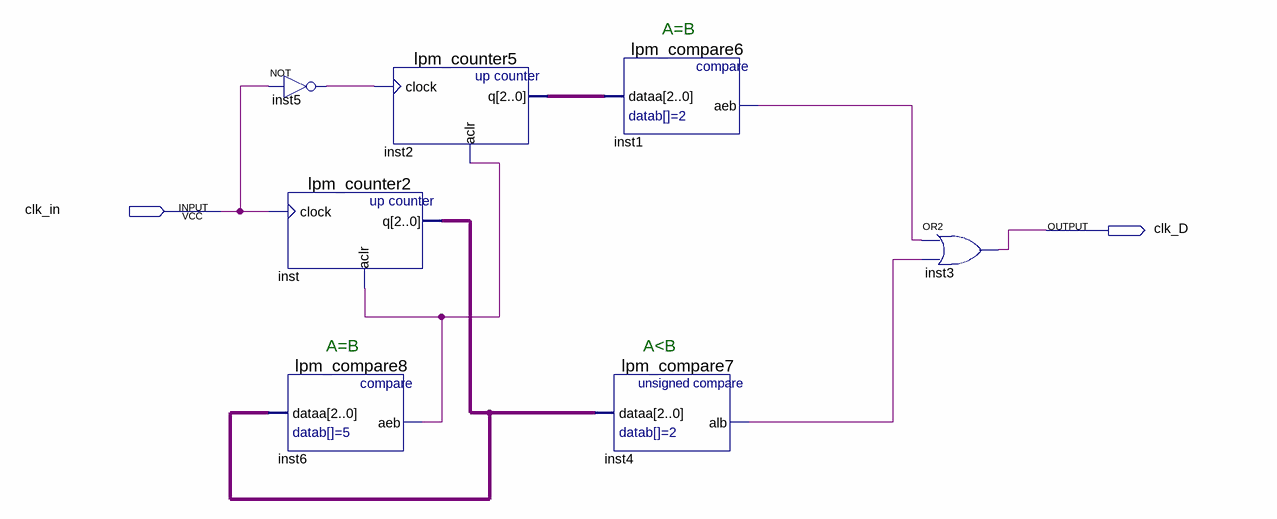
[diagram p0: schematic sheet]
// Quartus schematic Block2.bdf as structural Verilog: 7 symbols, 2 pins
module Block2 (
  input  clk_in,
  output clk_D
);

  wire inst1_aeb, inst4_alb, inst5_out, inst6_aeb;
  wire [2:0] inst2_q, inst_q;

  not inst5 (inst5_out, clk_in);
  lpm_counter2 inst (.clock(clk_in), .aclr(inst6_aeb), .q(inst_q));
  lpm_compare8 inst6 (.dataa(inst_q), .aeb(inst6_aeb));
  lpm_counter5 inst2 (.clock(inst5_out), .aclr(inst6_aeb), .q(inst2_q));
  lpm_compare6 inst1 (.dataa(inst2_q), .aeb(inst1_aeb));
  lpm_compare7 inst4 (.dataa(inst_q), .alb(inst4_alb));
  or inst3 (clk_D, inst1_aeb, inst4_alb);

  // Notes on the sheet:
  //   A=B
  //   A=B
  //   A<B
endmodule
